# EAGLE design BUZZI-47 (EAGLE 5.01)
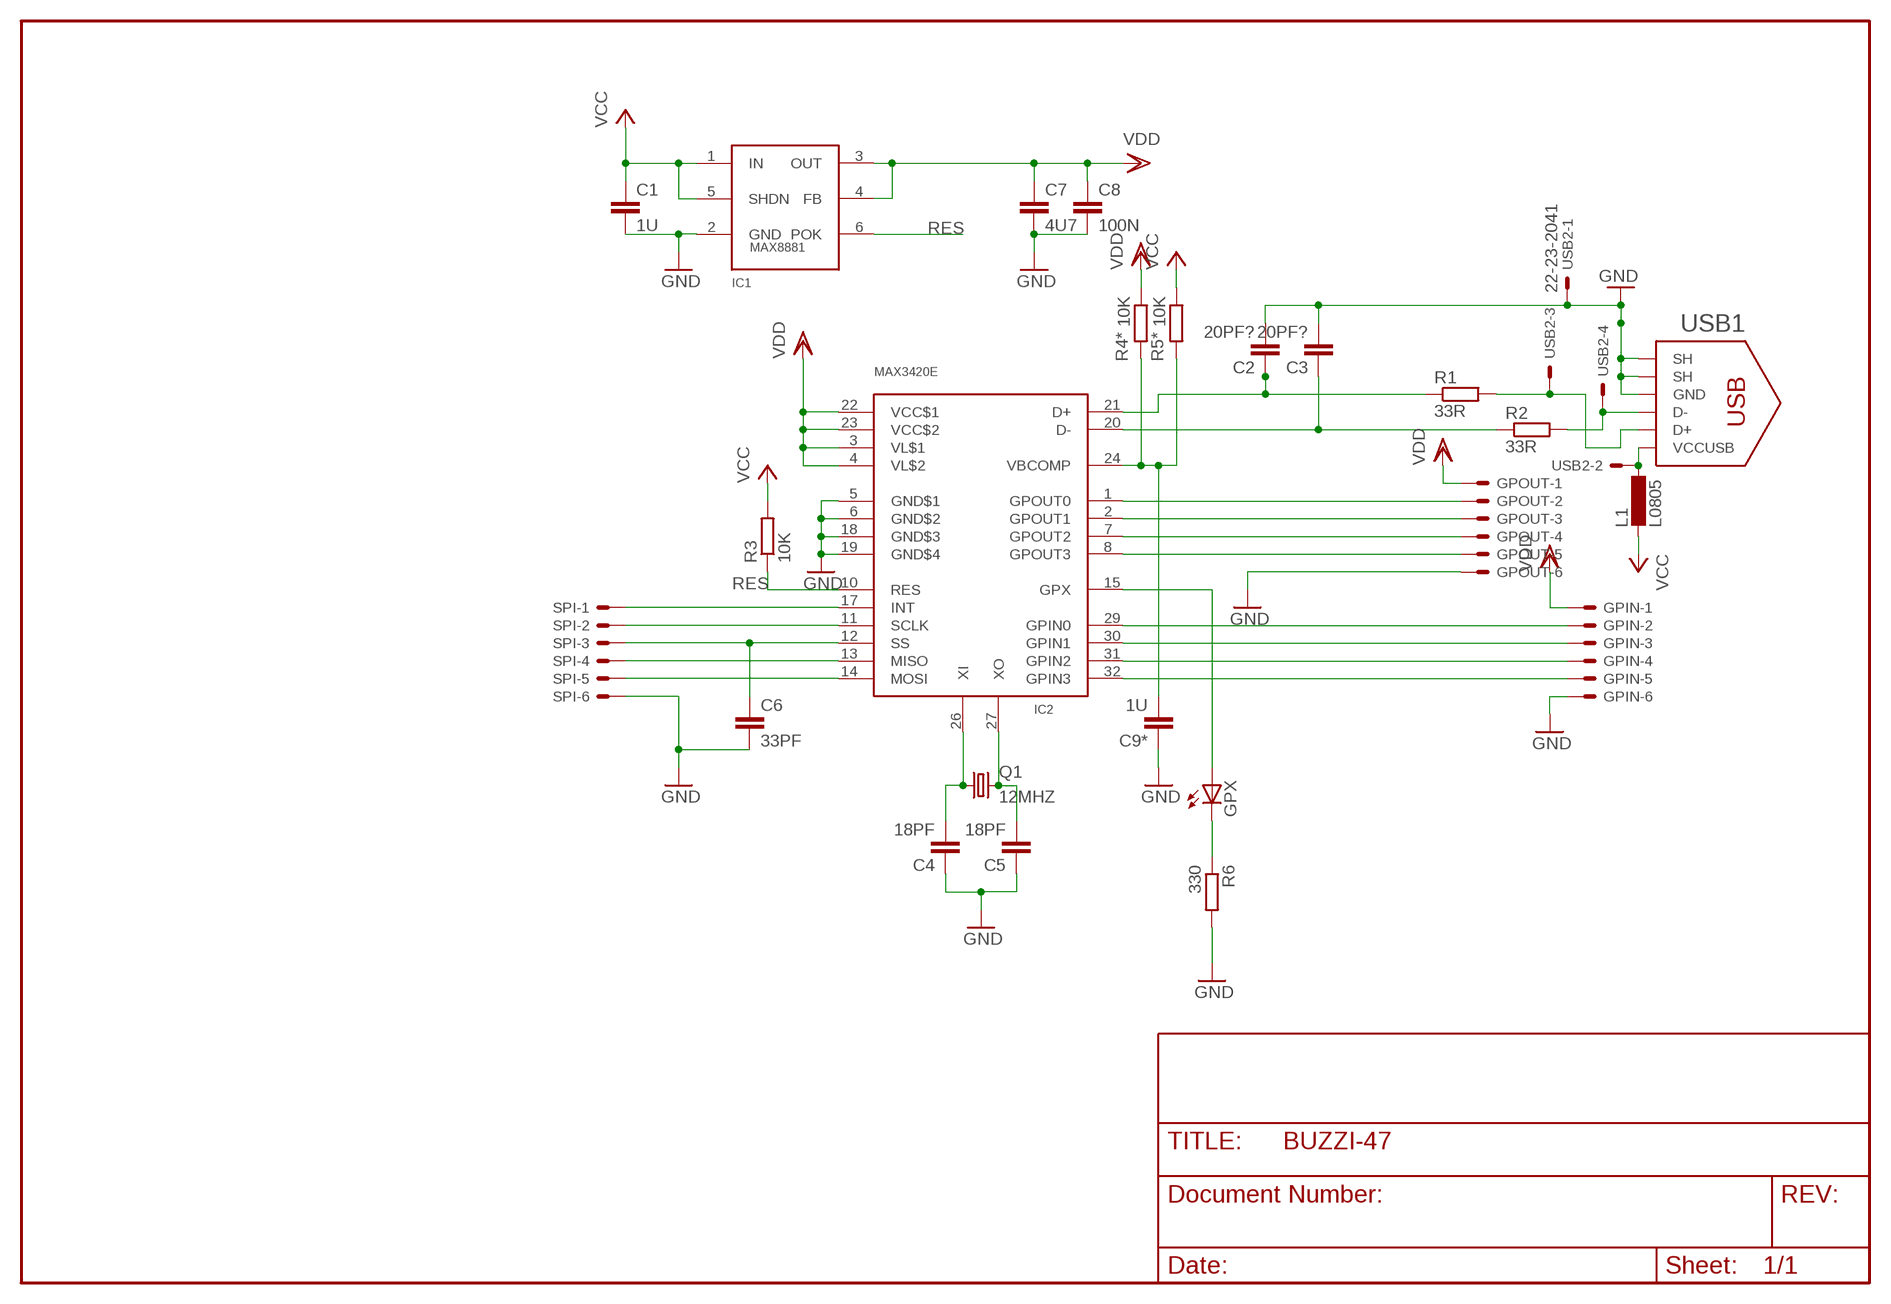
[diagram p0: schematic, sheet 1]

## Parts
C1  1U  C-EUC0805  [C0805]
C2  20PF?  C-EUC0805  [C0805]
C3  20PF?  C-EUC0805  [C0805]
C4  18PF  C-EUC0805  [C0805]
C5  18PF  C-EUC0805  [C0805]
C6  33PF  C-EUC0805  [C0805]
C7  4U7  C-EUC0805  [C0805]
C8  100N  C-EUC0805  [C0805]
C9*  1U  C-EUC0805  [C0805]
GPIN  22-23-2061  [22-23-2061]
GPOUT  22-23-2061  [22-23-2061]
GPX  LEDCHIP-LED0805  [CHIP-LED0805]
IC1  MAX8881  [SOT23-6L]
IC2  MAX3420E  [TQFP32-08]
L1  L0805  [C0805]
Q1  12MHZ  CRYTALHC49S  [HC49/S]
R1  33R  R-EU_M0805  [M0805]
R2  33R  R-EU_M0805  [M0805]
R3  10K  R-EU_M0805  [M0805]
R4*  10K  R-EU_M0805  [M0805]
R5*  10K  R-EU_M0805  [M0805]
R6  330  R-EU_M0805  [M0805]
SPI  22-23-2061  [22-23-2061]
USB1  USBCONN  [PN61729]
USB2  22-23-2041  [22-23-2041]

## Nets
D+: C2.1 IC2.21(D+) R1.1
D+O: R1.2 USB1.3(D+) USB2.3
D-: C3.1 IC2.20(D-) R2.1
D-O: R2.2 USB1.2(D-) USB2.4
GND: C1.2 C2.2 C3.2 C4.1 C5.1 C6.2 C7.2 C8.2 C9*.1 GPIN.6 GPOUT.6 IC1.2(GND) IC2.5(GND$1) IC2.6(GND$2) IC2.18(GND$3) IC2.19(GND$4) R6.2 SPI.6 USB1.4(GND) USB1.SHIELD1(SH) USB1.SHIELD2(SH) USB2.1
GPIN0: GPIN.2 IC2.29(GPIN0)
GPIN1: GPIN.3 IC2.30(GPIN1)
GPIN2: GPIN.4 IC2.31(GPIN2)
GPIN3: GPIN.5 IC2.32(GPIN3)
GPOUT0: GPOUT.2 IC2.1(GPOUT0)
GPOUT1: GPOUT.3 IC2.2(GPOUT1)
GPOUT2: GPOUT.4 IC2.7(GPOUT2)
GPOUT3: GPOUT.5 IC2.8(GPOUT3)
GPX: GPX.A IC2.15(GPX)
INT: IC2.17(INT) SPI.1
MISO: IC2.13(MISO) SPI.4
MOSI: IC2.14(MOSI) SPI.5
N$1: C4.2 IC2.26(XI) Q1.1
N$2: C5.2 IC2.27(XO) Q1.2
N$3: L1.1 USB1.1(VCCUSB) USB2.2
N$4: C9*.2 IC2.24(VBCOMP) R4*.2 R5*.2
N$7: GPX.C R6.1
RES: IC1.6(POK) IC2.10(RES) R3.1
SCLK: IC2.11(SCLK) SPI.2
SS: C6.1 IC2.12(SS) SPI.3
VCC: C1.1 IC1.1(IN) IC1.5(SHDN) L1.2 R3.2 R5*.1
VDD: C7.1 C8.1 GPIN.1 GPOUT.1 IC1.3(OUT) IC1.4(FB) IC2.3(VL$1) IC2.4(VL$2) IC2.22(VCC$1) IC2.23(VCC$2) R4*.1

## Library data of the parts
C1-C8 C9* = turbod3:C-EU: CAPACITOR, European symbol
GPIN GPOUT SPI = con-molex:22-23-2061: .100" (2.54mm) Center Header - 6 Pin
GPX = led:LED: LED OSRAM: - CHIPLED LG R971, LG N971, LY N971, LG Q971, LY Q971, LO R971, LY R971 LH N974, LH R974 LS Q976, LO Q976, LY Q976 LO Q996 - Hyper CHIPLED LW Q18S LB Q993, LB Q99A, LB R99A - SideLED LS A670, LO A670, LY A670, LG A670, LP A670 LB A673, LV A673, LT A673, LW A673 LH A674 LY A675 LS A676, LA A676, LO A676, LY A676, LW A676 LS A679, LY A679, LG A679 - Hyper Micro SIDELED® LS Y876, LA Y876, LO Y876, LY Y876 LT Y87S - SmartLED LW L88C, LW L88S LB L89C, LB L89S, LG L890 LS L89K, LO L89K, LY L89K LS L896, LA L896, LO L896, LY L896 - TOPLED LS T670, LO T670, LY T670, LG T670, LP T670 LSG T670, LSP T670, LSY T670, LOP T670, LYG T670 LG T671, LOG T671, LSG T671 LB T673, LV T673, LT T673, LW T673 LH T674 LS T676, LA T676, LO T676, LY T676, LB T676, LH T676, LSB T676, LW T676 LB T67C, LV T67C, LT T67C, LS T67K, LO T67K, LY T67K, LW E67C LS E67B, LA E67B, LO E67B, LY E67B, LB E67C, LV E67C, LT E67C LW T67C LS T679, LY T679, LG T679 LS T770, LO T770, LY T770, LG T770, LP T770 LB T773, LV T773, LT T773, LW T773 LH T774 LS E675, LA E675, LY E675, LS T675 LS T776, LA T776, LO T776, LY T776, LB T776 LHGB T686 LT T68C, LB T68C - Hyper Mini TOPLED® LB M676 - Mini TOPLED Santana® LG M470 LS M47K, LO M47K, LY M47K Source: http://www.osram.convergy.de - LUMILED® LXK2-PW12-R00, LXK2-PW12-S00, LXK2-PW14-U00, LXK2-PW14-V00 LXK2-PM12-R00, LXK2-PM12-S00, LXK2-PM14-U00 LXK2-PE12-Q00, LXK2-PE12-R00, LXK2-PE12-S00, LXK2-PE14-T00, LXK2-PE14-U00 LXK2-PB12-K00, LXK2-PB12-L00, LXK2-PB12-M00, LXK2-PB14-N00, LXK2-PB14-P00, LXK2-PB14-Q00 LXK2-PR12-L00, LXK2-PR12-M00, LXK2-PR14-Q00, LXK2-PR14-R00 LXK2-PD12-Q00, LXK2-PD12-R00, LXK2-PD12-S00 LXK2-PH12-R00, LXK2-PH12-S00 LXK2-PL12-P00, LXK2-PL12-Q00, LXK2-PL12-R00 Source: www.luxeon.com
IC1 = turbod3:MAX8881
IC2 = turbod3:MAX3420E
L1 = turbod3:L
Q1 = turbod3:CRYTAL: CRYSTAL
R1-R3 R4* R5* R6 = turbod3:R-EU_: RESISTOR, European symbol
USB1 = turbod3:USBCONN
USB2 = con-molex:22-23-2041: .100" (2.54mm) Center Header - 4 Pin

## Board
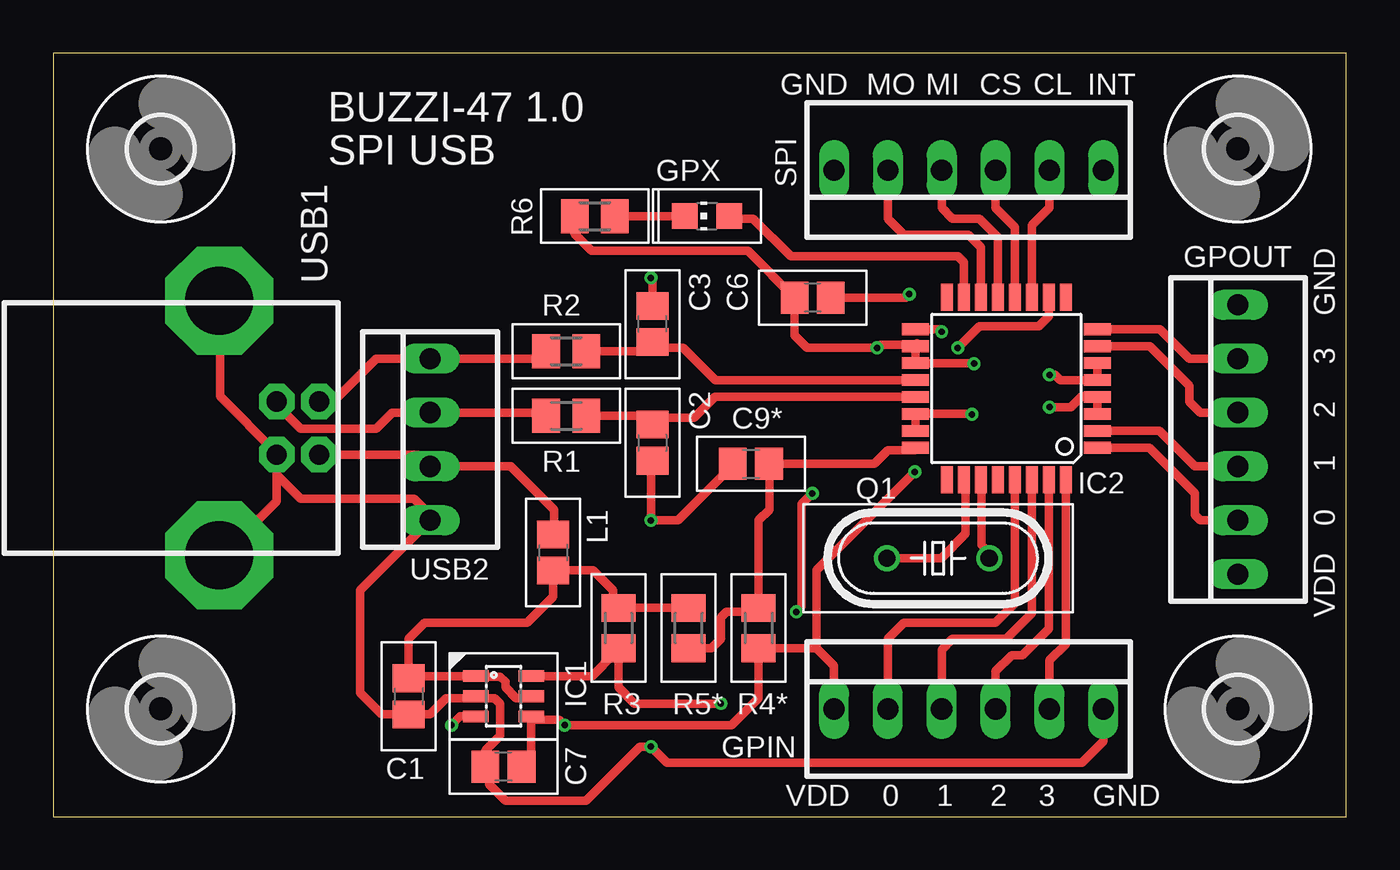
[diagram p1: board, top side]
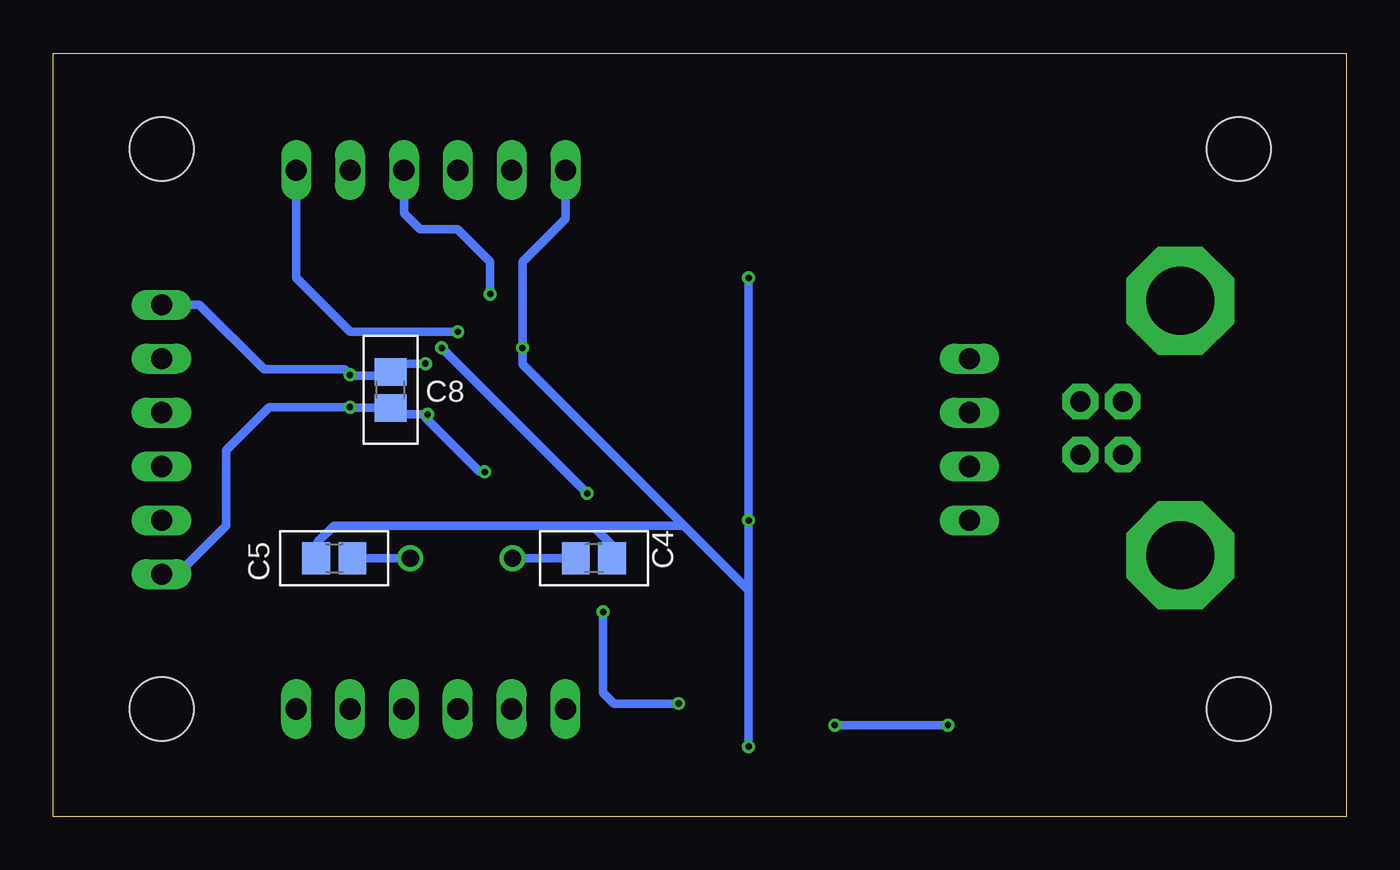
[diagram p2: board, bottom side, seen from below]

Size 61 x 36 mm. Coordinates in mm from the lower left corner, seen from the top.
Outline: 0,0 61,0 61,36 0,36 0,0
Copper layers (1*16): Top 0.035mm / dielectric 1.5mm / Bottom 0.035mm
Design rules "PCB-POOL": minimum track width 6mil, minimum drill 12mil, track to track 6mil, track to pad 6mil, pad to pad 6mil, via to via 6mil, smd to smd 6mil, copper to edge 20mil, drill to drill 8mil, minimum pad ring 8mil, minimum via ring 6mil, stop-mask expansion 3mil, vias tented up to drill 0mil, thermal gap 8mil

### Footprints (pad centres in the part's own frame; a part is rotated, then mirrored left to right if it is on the bottom)
C0805 = smd 1.3 x 1.5: 1 -0.85,0; 2 0.85,0
22-23-2061 = drill 1 long: 1 -6.35,0; 2 -3.81,0; 3 -1.27,0; 4 1.27,0; 5 3.81,0; 6 6.35,0
CHIP-LED0805 = smd 1.2 x 1.2: A 0,-1.05; C 0,1.05
SOT23-6L = smd 0.55 x 1.2: 1 -0.95,-1.3; 2 0,-1.3; 3 0.95,-1.3; 4 0.95,1.3; 5 0,1.3; 6 -0.95,1.3
TQFP32-08 = smd 1.27 x 0.559: 1 -4.293,2.8; 2 -4.293,2; 3 -4.293,1.2; 4 -4.293,0.4; 5 -4.293,-0.4; 6 -4.293,-1.2; 7 -4.293,-2; 8 -4.293,-2.8; 17 4.293,-2.8; 18 4.293,-2; 19 4.293,-1.2; 20 4.293,-0.4; 21 4.293,0.4; 22 4.293,1.2; 23 4.293,2; 24 4.293,2.8 | smd 0.559 x 1.27: 9 -2.8,-4.293; 10 -2,-4.293; 11 -1.2,-4.293; 12 -0.4,-4.293; 13 0.4,-4.293; 14 1.2,-4.293; 15 2,-4.293; 16 2.8,-4.293; 25 2.8,4.293; 26 2,4.293; 27 1.2,4.293; 28 0.4,4.293; 29 -0.4,4.293; 30 -1.2,4.293; 31 -2,4.293; 32 -2.8,4.293
HC49/S = drill 0.813 round: 1 -2.413,0; 2 2.413,0
M0805 = smd 1.3 x 1.6: 1 -0.95,0; 2 0.95,0
3,0 = hole 3: 0,0
PN61729 = drill 0.95 pad 1.676 octagon: 1 1.25,4.71; 2 -1.25,4.71; 3 -1.25,2.71; 4 1.25,2.71 | drill 3.2 pad 5.08 octagon: SHIELD1 -6,0; SHIELD2 6,0
22-23-2041 = drill 1 long: 1 -3.81,0; 2 -1.27,0; 3 1.27,0; 4 3.81,0

### Placement (x,y rotation side)
C1  16.77,5.68 270 top
C2  28.27,17.63 270 top
C3  28.27,23.22 90 top
C4  35.49,12.18 180 bottom
C5  47.74,12.18 0 bottom
C6  35.82,24.47 180 top
C7  21.25,2.36 180 top
C8  45.08,20.12 90 bottom
C9*  32.92,16.63 0 top
GPIN  43.18,5.08 0 top
GPOUT  55.88,17.78 90 top
GPX  30.84,28.31 90 top
IC1  21.25,5.68 270 top
IC2  44.96,20.18 180 top
L1  23.58,12.46 270 top
Q1  41.74,12.18 0 top
R1  24.2,18.9 180 top
R2  24.2,21.95 180 top
R3  26.67,8.89 90 top
R4*  33.27,8.89 90 top
R5*  29.97,8.89 270 top
R6  25.55,28.31 180 top
SPI  43.18,30.48 180 top
U$2  [3,0]  5.08,31.48 0 top
U$4  [3,0]  5.08,5.08 0 top
U$5  [3,0]  55.88,31.48 0 top
U$6  [3,0]  55.88,5.08 0 top
USB1  7.84,18.32 270 top
USB2  17.78,17.78 90 top

### Tracks (layer width: path | path; a pad name or v marks a point on that pad's centre or on a via)
D+
  Top 0.406: 28.45,18.8 28.27,18.61 C2.1 28.26,18.48 28.19,18.54 28.45,18.8 | R1.1 28.34,18.9 28.45,18.8 | IC2.21 31.21,19.78 30.23,18.8 28.45,18.8
D+O
  Top 0.406: USB1.3 10.55,19.42 11.68,18.29 15.24,18.29 16,19.05 USB2.3 23.37,19.05 23.25,18.93 R1.2
D-
  Top 0.406: R2.1 28.3,21.95 28.45,22.1 28.27,22.28 C3.1 28.27,22.17 28.19,22.1 29.72,22.1 31.23,20.58 IC2.20
D-O
  Top 0.406: USB1.2 13.22,19.57 15.24,21.59 USB2.4 23.37,21.59 23.25,21.71 R2.2
GND  (via drill 0.3)
  Top 0.406: v43.44,21.36 43.41,21.38 IC2.19 40.67,22.25 | IC2.6 49.26,20.72 49.28,20.69 49.26,20.67 IC2.5 49.03,20.58 49.02,20.57 47.5,20.57 47.24,20.83 v46.99,20.83 | 40.67,22.25 IC2.18 | 40.67,22.25 40.74,22.32 | USB1.4 10.55,16.12 11.68,14.99 17.02,14.99 18.03,13.97 USB2.1 14.48,10.67 14.48,5.84 15.49,4.83 C1.2 | USB1.SHIELD2 7.84,12.23 7.87,12.19 10.55,14.87 USB1.4 | USB1.4 10.55,17.14 7.87,19.81 7.87,24.13 7.68,24.32 | 7.68,24.32 7.62,24.38 | 7.68,24.32 USB1.SHIELD1 | 19.81,5.59 18.54,5.59 17.78,4.83 C1.2 | 19.81,5.59 19.9,5.68 IC1.2 | 19.81,5.59 20.83,5.59 21.08,5.33 21.08,3.81 20.4,3.13 C7.2 20.4,2.46 | C1.2 | 20.4,2.46 20.32,2.54 | 20.4,2.46 20.57,2.29 20.57,1.52 21.34,0.76 25.15,0.76 27.69,3.3 v28.19,3.3 28.96,2.54 48.51,2.54 49.53,3.56 GPIN.6 | C3.2 28.27,25.33 v28.19,25.4 | C2.2 28.27,16.58 28.19,16.51 v28.19,13.97 29.46,13.97 32.07,16.57 C9*.1 | 40.67,22.25 39.01,22.25 v38.86,22.1 35.56,22.1 34.97,22.68 C6.2 | R6.2 24.6,27.47 25.4,26.67 32.77,26.67 C6.2 | C6.2 35.05,24.38
  Bottom 0.406: 45.14,20.97 45.32,20.8 46.96,20.8 v46.99,20.83 47.24,21.08 51.05,21.08 54.1,24.13 GPOUT.6 | 45.14,20.97 C8.2 | v43.44,21.36 44.76,21.36 45.14,20.97 | C4.1 34.64,12.79 35.56,13.72 | 35.56,13.72 47.75,13.72 48.51,12.95 48.51,12.45 48.77,12.19 48.76,12.18 C5.1 | v28.19,25.4 v28.19,13.97 28.19,10.41 | 38.86,21.84 38.86,21.34 31.24,13.72 | 31.24,13.72 28.19,10.67 28.19,10.41 | v28.19,3.3 28.19,10.41 | 31.24,13.72 35.56,13.72 | SPI.6 36.83,28.19 38.86,26.16 38.86,21.84 | 38.86,21.84 v38.86,22.1
GPIN0
  Top 0.406: IC2.29 45.36,10.06 44.45,9.14 40.13,9.14 39.37,8.38 GPIN.2
GPIN1
  Top 0.406: IC2.30 46.16,9.59 44.96,8.38 42.42,8.38 41.91,7.87 GPIN.3
GPIN2
  Top 0.406: IC2.31 46.96,8.86 45.72,7.62 45.21,7.62 44.45,6.86 GPIN.4
GPIN3
  Top 0.406: IC2.32 47.76,8.14 46.99,7.37 GPIN.5
GPOUT0
  Top 0.406: IC2.1 51.7,17.38 53.85,15.24 53.85,14.22 54.1,13.97 GPOUT.2
GPOUT1
  Top 0.406: IC2.2 52.17,18.18 53.85,16.51 GPOUT.3 56.13,16.51
GPOUT2
  Top 0.406: IC2.7 51.73,22.18 53.59,20.32 53.59,19.56 54.1,19.05 GPOUT.4
GPOUT3
  Top 0.406: IC2.8 52.2,22.98 53.59,21.59 GPOUT.5
GPX
  Top 0.406: IC2.15 42.96,26.13 42.67,26.42 34.8,26.42 33.02,28.19 31.75,28.19 31.87,28.31 GPX.A
INT  (via drill 0.3)
  Top 0.406: IC2.17 41.79,22.98 v41.91,22.86
  Bottom 0.406: 49.53,30.73 SPI.1 49.53,25.4 46.99,22.86 v41.91,22.86
MISO
  Top 0.406: IC2.13 44.56,27.32 43.69,28.19 42.42,28.19 41.91,28.7 SPI.4
MOSI
  Top 0.406: IC2.14 43.76,26.85 43.18,27.43 40.13,27.43 39.37,28.19 SPI.5
N$1
  Top 0.406: Q1.1 41.89,12.18 43.03,13.33 43.03,15.87 43.01,15.89 IC2.26
  Bottom 0.406: C4.2 36.3,12.18 | 36.3,12.18 Q1.1 | 36.3,12.18 36.17,12.06
N$2
  Top 0.406: Q1.2 44.15,12.46 43.79,12.82 43.79,15.87 IC2.27
  Bottom 0.406: C5.2 46.89,12.11 46.84,12.06 46.71,12.18 Q1.2
N$3
  Top 0.406: USB1.1 17.22,17.07 USB2.2 21.59,16.51 23.62,14.48 23.62,12.95 23.58,12.99 L1.1
N$4
  Top 0.406: R5*.2 31.05,7.94 31.5,8.38 31.5,9.4 31.75,9.65 33.02,9.65 33.27,9.91 R4*.2 33.27,13.97 33.78,14.48 33.78,16.51 33.77,16.53 C9*.2 38.73,16.63 39.37,17.27 40.64,17.27 40.67,17.3 IC2.24
N$7
  Top 0.406: 26.5,28.36 26.42,28.45 | R6.1 26.5,28.36 | GPX.C 26.55,28.31 26.5,28.36
RES  (via drill 0.3)
  Top 0.406: R3.1 26.51,7.72 25.42,6.63 IC1.6 | v35.81,15.24 35.31,14.73 35.31,9.91 v35.05,9.65 | R3.1 26.67,8.13 | R3.1 26.67,6.1 27.43,5.33 v31.5,5.33 | IC2.10 46.96,23.59 46.48,23.11 43.69,23.11 v42.67,22.1
  Bottom 0.406: v35.05,9.65 35.05,5.84 34.54,5.33 v31.5,5.33 | v35.81,15.24 v42.67,22.1
SCLK
  Top 0.406: IC2.11 46.16,27.87 46.99,28.7 SPI.2
SS  (via drill 0.3)
  Top 0.406: IC2.12 45.36,27.79 44.45,28.7 SPI.3 | C6.1 40.22,24.47 v40.39,24.64
  Bottom 0.406: v40.39,24.64 40.39,26.16 41.91,27.69 43.69,27.69 44.45,28.45 SPI.3 44.45,30.73
VCC
  Top 0.406: IC1.5 22.55,5.65 22.61,5.59 21.84,5.59 21.34,6.1 21.34,6.35 21.08,6.6 20.07,6.6 20.04,6.63 IC1.1 16.53,6.63 16.51,6.6 16.59,6.53 C1.1 16.77,6.36 16.76,6.35 16.76,8.38 17.53,9.14 22.35,9.14 23.58,10.38 L1.2 25.48,11.61 26.42,10.67 26.42,9.65 26.51,9.75 R3.2 29.91,9.84 29.97,9.91 R5*.1
VDD  (via drill 0.3)
  Top 0.406: v43.34,18.97 43.32,18.98 IC2.22 40.67,18.32 40.64,18.29 40.67,18.26 IC2.23 | 22.1,2.29 | C7.1 22.1,2.29 | 22.1,2.29 22.55,2.74 IC1.4 22.55,4.63 22.61,4.57 23.88,4.57 v24.13,4.32 32,4.32 33.27,5.59 R4*.1 36,7.94 | IC1.3 19.2,4.73 v18.8,4.32 | v46.99,19.3 48.01,19.3 48.51,19.81 49.28,19.81 49.26,19.79 IC2.4 49.26,19.07 49.28,19.05 49.26,19.03 IC2.3 | 36,7.94 36.83,7.11 GPIN.1 | 36,7.94 36,11.62 v40.64,16.26
  Bottom 0.406: 45.21,19.27 45.22,19.27 44.91,18.97 v43.34,18.97 43.34,18.89 43.43,18.8 40.89,16.26 v40.64,16.26 | 45.21,19.27 C8.1 | v24.13,4.32 v18.8,4.32 | 45.21,19.27 46.96,19.27 v46.99,19.3 50.8,19.3 52.83,17.27 52.83,13.72 55.12,11.43 GPOUT.1

### Text on the board
tNames: GND | MO | MI | CS | CL | INT | BUZZI-47 1.0 | SPI USB | GND | 3 | 2 | 1 | 0 | VDD | VDD | 0 | 1 | 2 | 3 | GND